# EAGLE schematic powerSupply (EAGLE 9.6.2)
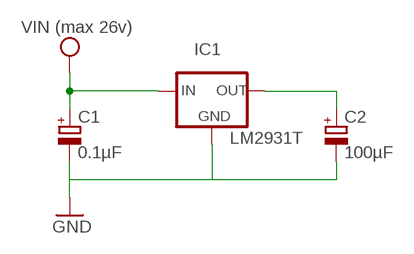
[diagram p0: schematic, sheet 1]

## Parts
C1  0.1µF  CPOL-EUE5-5  [E5-5]
C2  100µF  CPOL-EUE5-5  [E5-5]
IC1  LM2931T  [TO220S]

## Nets
GND: C1.- C2.- IC1.2(GND)
N$1: C2.+ IC1.3(OUT)
VCC: C1.+ IC1.1(IN) ; supply symbol labelled VIN (max 26v)

## Library data of the parts
C1 C2 = rcl:CPOL-EU: POLARIZED CAPACITOR, European symbol; SPICEPREFIX: C
IC1 = v-reg-3:LM2931: National Semiconductor <http://www.national.com> Low Dropout Fixed Regulator Vin up to 26V, Reverse Batterie/Load Dump/Short Circuit/Overload Protection,